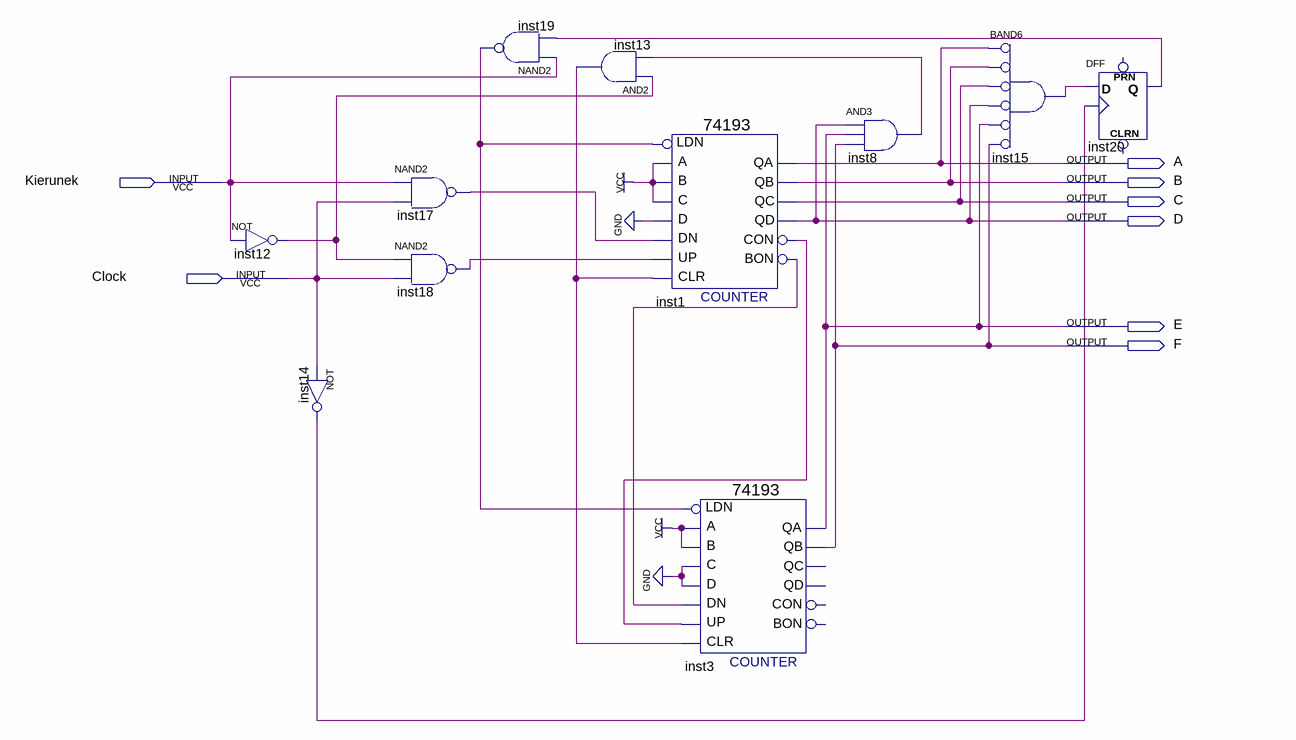
[diagram p0: schematic sheet]
// Quartus schematic proj1.bdf as structural Verilog: 11 symbols, 8 pins
module proj1 (
  input  Kierunek,
  input  Clock,
  output A,
  output B,
  output C,
  output D,
  output E,
  output F
);

  wire inst1_bon, inst1_con, inst8_out, inst12_out, inst13_out, inst14_out, inst15_out, inst17_out,
       inst18_out, inst19_out, inst20_q;

  not inst12 (inst12_out, Kierunek);
  not inst14 (inst14_out, Clock);
  nand inst17 (inst17_out, Kierunek, Clock);
  nand inst18 (inst18_out, inst12_out, Clock);
  nand inst19 (inst19_out, Kierunek, inst20_q);
  and inst13 (inst13_out, inst12_out, inst8_out);
  \74193  inst1 (
    .D(1'b0), .C(1'b1), .B(1'b1), .A(1'b1), .CLR(inst13_out), .UP(inst18_out), .DN(inst17_out),
    .LDN(inst19_out), .QB(B), .QA(A), .CON(inst1_con), .QD(D), .QC(C), .BON(inst1_bon));
  \74193  inst3 (
    .D(1'b0), .C(1'b0), .B(1'b1), .A(1'b1), .CLR(inst13_out), .UP(inst1_con), .DN(inst1_bon),
    .LDN(inst19_out), .QB(F), .QA(E));  // open: CON, QD, QC, BON
  and inst8 (inst8_out, D, E, F);
  and inst15 (inst15_out, ~A, ~B, ~C, ~D, ~E, ~F);  // BAND6
  DFF inst20 (.CLK(inst14_out), .D(inst15_out), .Q(inst20_q));  // open: CLRN, PRN
endmodule
